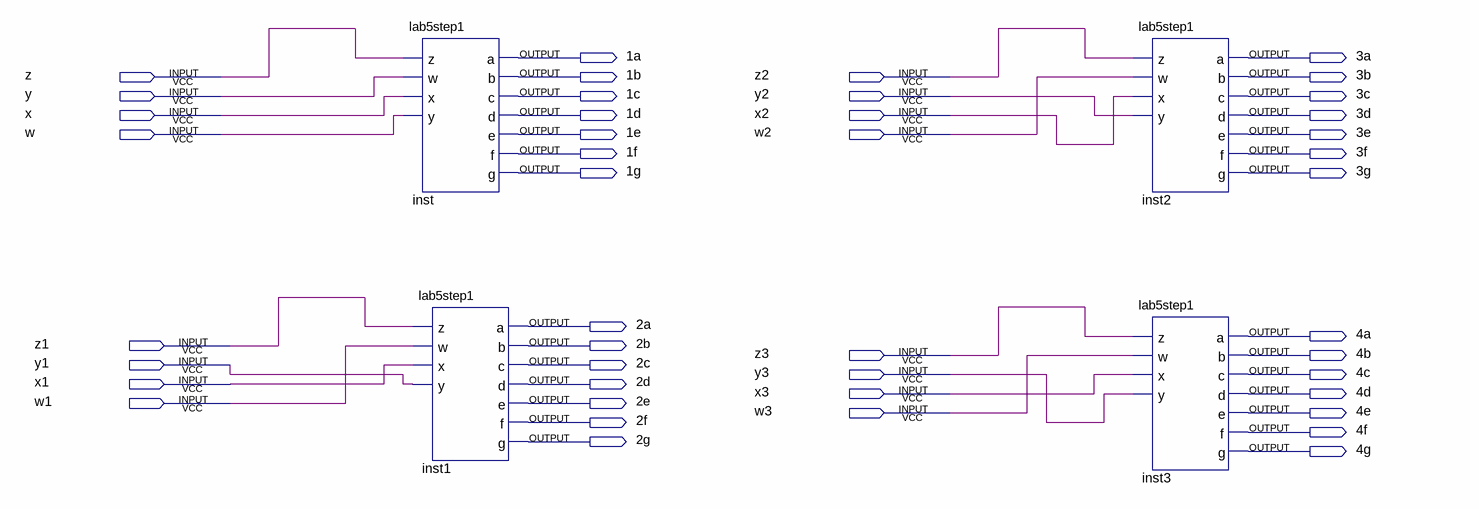
[diagram p0: schematic sheet]
// Quartus schematic lab5step2.bdf as structural Verilog: 4 symbols, 44 pins
module lab5step2 (
  input  z,
  input  z2,
  input  y,
  input  y2,
  input  x,
  input  x2,
  input  w,
  input  w2,
  input  z1,
  input  z3,
  input  y1,
  input  y3,
  input  x1,
  input  x3,
  input  w1,
  input  w3,
  output \1a ,
  output \3a ,
  output \1b ,
  output \3b ,
  output \1c ,
  output \3c ,
  output \1d ,
  output \3d ,
  output \1e ,
  output \3e ,
  output \1f ,
  output \3f ,
  output \1g ,
  output \3g ,
  output \2a ,
  output \4a ,
  output \2b ,
  output \4b ,
  output \2c ,
  output \4c ,
  output \2d ,
  output \4d ,
  output \2e ,
  output \4e ,
  output \2f ,
  output \4f ,
  output \2g ,
  output \4g 
);

  lab5step1 inst (.z(z), .w(y), .x(x), .y(w), .a(\1a ), .b(\1b ), .c(\1c ), .d(\1d ), .e(\1e ), .f(\1f ), .g(\1g ));
  lab5step1 inst1 (
    .z(z1), .w(w1), .x(x1), .y(y1), .a(\2a ), .b(\2b ), .c(\2c ), .d(\2d ), .e(\2e ), .f(\2f ), .g(\2g ));
  lab5step1 inst2 (
    .z(z2), .w(w2), .x(x2), .y(y2), .a(\3a ), .b(\3b ), .c(\3c ), .d(\3d ), .e(\3e ), .f(\3f ), .g(\3g ));
  lab5step1 inst3 (
    .z(z3), .w(w3), .x(x3), .y(y3), .a(\4a ), .b(\4b ), .c(\4c ), .d(\4d ), .e(\4e ), .f(\4f ), .g(\4g ));
endmodule
